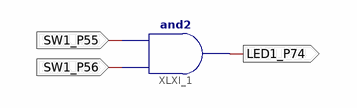
[diagram p0: schematic sheet 1]
// Xilinx ISE schematic Lab04_1.sch (spartan6) as structural Verilog: 1 symbols, 3 ports
module Lab04_1 (
  input  SW1_P55,
  input  SW1_P56,
  output LED1_P74
);

  and XLXI_1 (LED1_P74, SW1_P56, SW1_P55);
endmodule
